# EAGLE design Wiz810mjMikroBUS_SIL3 (EAGLE 6.4)
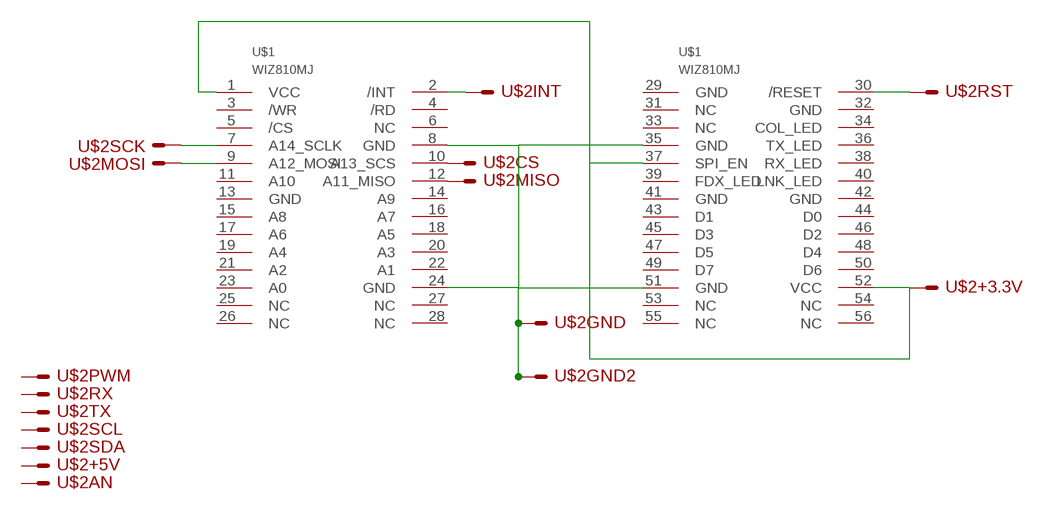
[diagram p0: schematic, sheet 1]

## Parts
U$1  WIZ810MJ  [WIZ810MJ]
U$2  MIKROBUSSIL  [MIKROBUS_SIL]

## Nets
N$1: U$1.2(/INT) U$2.INT
N$4: U$1.30(/RESET) U$2.RST
N$5: U$1.10(A13_SCS) U$2.CS
N$6: U$1.7(A14_SCLK) U$2.SCK
N$7: U$1.12(A11_MISO) U$2.MISO
N$8: U$1.9(A12_MOSI) U$2.MOSI
N$9: U$1.1(VCC) U$1.37(SPI_EN) U$1.52(VCC) U$2.+3.3V
N$27: U$1.8(GND) U$1.24(GND) U$1.35(GND) U$1.51(GND) U$2.GND U$2.GND2
Unconnected: U$1.3(/WR) U$1.4(/RD) U$1.5(/CS) U$1.6(NC) U$1.11(A10) U$1.13(GND) U$1.14(A9) U$1.15(A8) U$1.16(A7) U$1.17(A6) U$1.18(A5) U$1.19(A4) U$1.20(A3) U$1.21(A2) U$1.22(A1) U$1.23(A0) U$1.25(NC) U$1.26(NC) U$1.27(NC) U$1.28(NC) U$1.29(GND) U$1.31(NC) U$1.32(GND) U$1.33(NC) U$1.34(COL_LED) U$1.36(TX_LED) U$1.38(RX_LED) U$1.39(FDX_LED) U$1.40(LNK_LED) U$1.41(GND) U$1.42(GND) U$1.43(D1) U$1.44(D0) U$1.45(D3) U$1.46(D2) U$1.47(D5) U$1.48(D4) U$1.49(D7) U$1.50(D6) U$1.53(NC) U$1.54(NC) U$1.55(NC) U$1.56(NC) U$2.+5V U$2.AN U$2.PWM U$2.RX U$2.SCL U$2.SDA U$2.TX

## Library data of the parts
U$1 = WIZNET:WIZ810MJ
U$2 = lieven:MIKROBUS

## Board
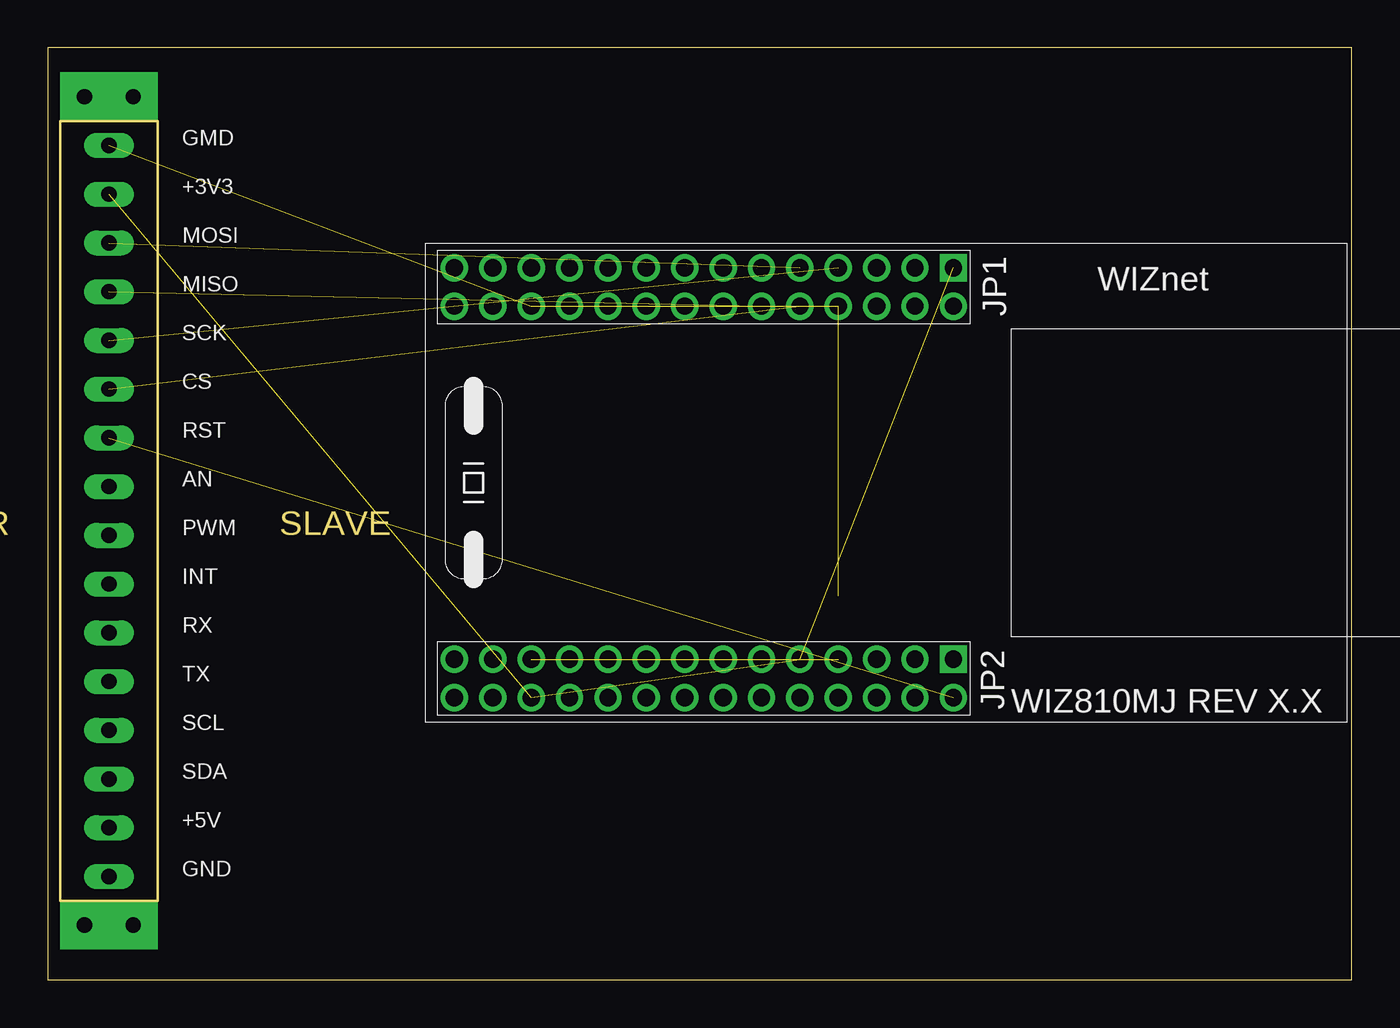
[diagram p1: board, top side]
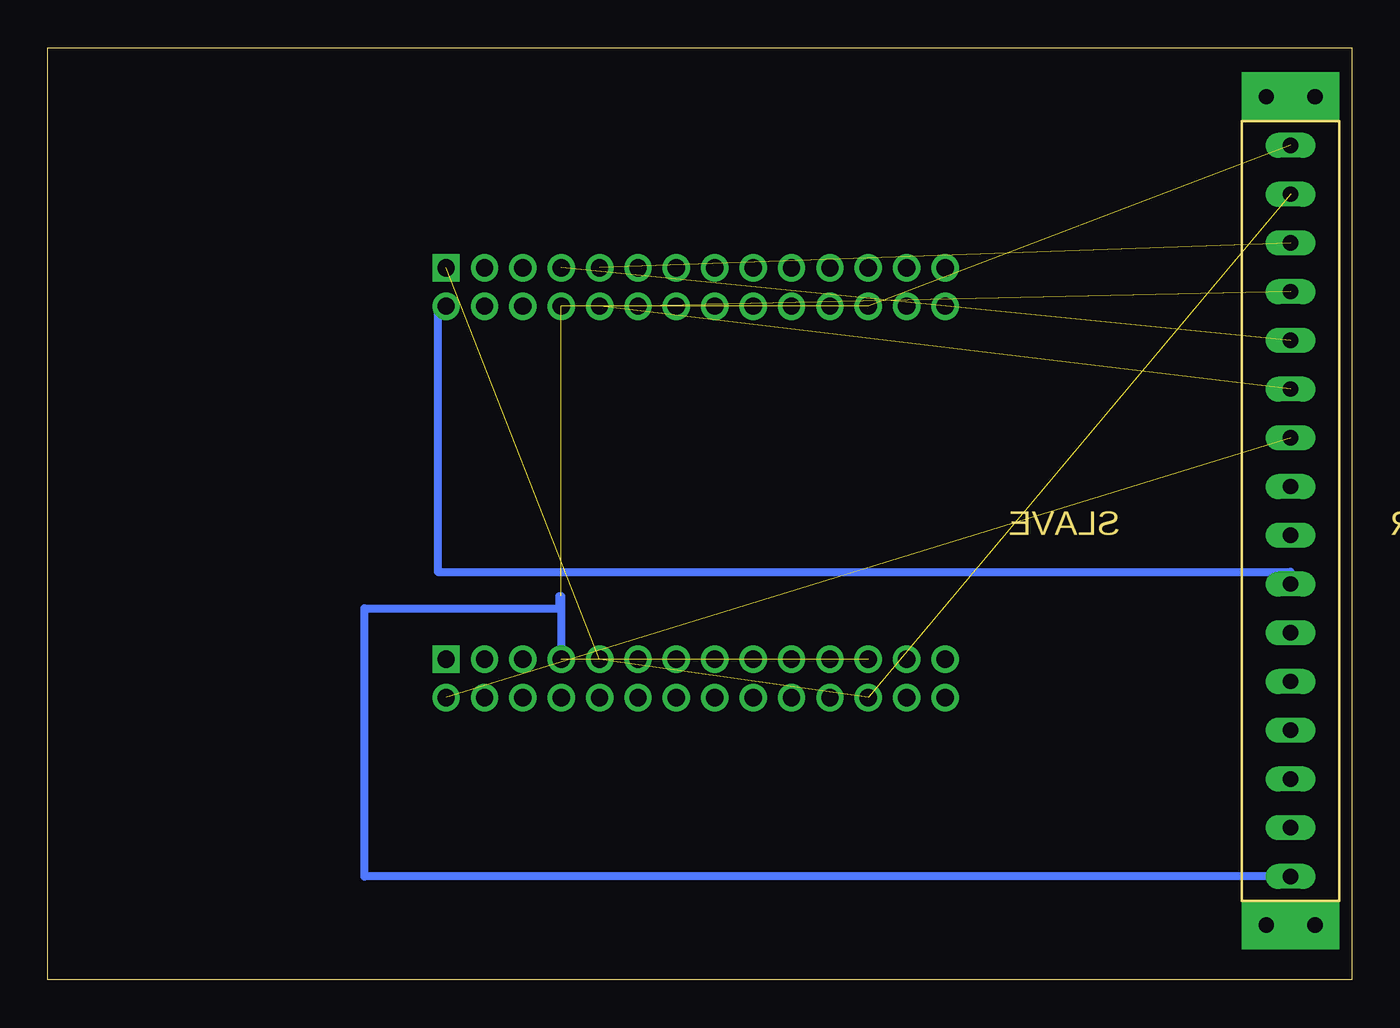
[diagram p2: board, bottom side, seen from below]

Size 67.94 x 48.56 mm. Coordinates in mm from the lower left corner, seen from the top.
Outline: 0,48.56 0,0 67.94,0 67.94,48.56 0,48.56
Copper layers (1*16): Top 0.035mm / dielectric 1.5mm / Bottom 0.035mm
Design rules "default": minimum track width 10mil, minimum drill 24mil, track to track 8mil, track to pad 8mil, pad to pad 8mil, via to via 8mil, smd to smd 8mil, copper to edge 40mil, drill to drill 8mil, minimum pad ring 10mil, minimum via ring 8mil, stop-mask expansion 4mil, vias tented up to drill 0mil, thermal gap 10mil

### Footprints (pad centres in the part's own frame; a part is rotated, then mirrored left to right if it is on the bottom)
WIZ810MJ = drill 0.9 pad 1.422 square: 1 27.5,-1.3; 29 27.5,-21.7 | drill 0.9 pad 1.422: 2 27.5,-3.3; 3 25.5,-1.3; 4 25.5,-3.3; 5 23.5,-1.3; 6 23.5,-3.3; 7 21.5,-1.3; 8 21.5,-3.3; 9 19.5,-1.3; 10 19.5,-3.3; 11 17.5,-1.3; 12 17.5,-3.3; 13 15.5,-1.3; 14 15.5,-3.3; 15 13.5,-1.3; 16 13.5,-3.3; 17 11.5,-1.3; 18 11.5,-3.3; 19 9.5,-1.3; 20 9.5,-3.3; 21 7.5,-1.3; 22 7.5,-3.3; 23 5.5,-1.3; 24 5.5,-3.3; 25 3.5,-1.3; 26 3.5,-3.3; 27 1.5,-1.3; 28 1.5,-3.3; 30 27.5,-23.7; 31 25.5,-21.7; 32 25.5,-23.7; 33 23.5,-21.7; 34 23.5,-23.7; 35 21.5,-21.7; 36 21.5,-23.7; 37 19.5,-21.7; 38 19.5,-23.7; 39 17.5,-21.7; 40 17.5,-23.7; 41 15.5,-21.7; 42 15.5,-23.7; 43 13.5,-21.7; 44 13.5,-23.7; 45 11.5,-21.7; 46 11.5,-23.7; 47 9.5,-21.7; 48 9.5,-23.7; 49 7.5,-21.7; 50 7.5,-23.7; 51 5.5,-21.7; 52 5.5,-23.7; 53 3.5,-21.7; 54 3.5,-23.7; 55 1.5,-21.7; 56 1.5,-23.7
MIKROBUS_SIL = drill 0.8 long: +3.3V 0,15.24; +5V 0,-17.78; AN 0,0; CS 0,5.08; GND 0,17.78; GND2 0,-20.32; INT 0,-5.08; MISO 0,10.16; MOSI 0,12.7; PWM 0,-2.54; RST 0,2.54; RX 0,-7.62; SCK 0,7.62; SCL 0,-12.7; SDA 0,-15.24; TX 0,-10.16 | drill 0.8 pad 2.54 square: P$1 1.27,-22.86; P$2 1.27,20.32; P$3 -1.27,20.32; P$4 -1.27,-22.86

### Placement (x,y rotation side)
U$1  19.69,38.41 0 top
U$2  3.18,25.7 0 top

### Tracks (layer width: path | path; a pad name or v marks a point on that pad's centre or on a via)
N$1
  Bottom 0.406: U$1.2 47.62,35.1 47.62,21.26 3.18,21.26 U$2.INT
N$4  (1 unrouted)
N$5  (1 unrouted)
N$6  (1 unrouted)
N$7  (1 unrouted)
N$8  (1 unrouted)
N$9  (3 unrouted)
N$27  (4 unrouted)
  Bottom 0.406: U$2.GND2 51.44,5.38 51.44,19.35 41.28,19.35 41.28,19.99 41.19,19.99 U$1.35